# EAGLE design MCT-1601 (EAGLE 7.6.0)
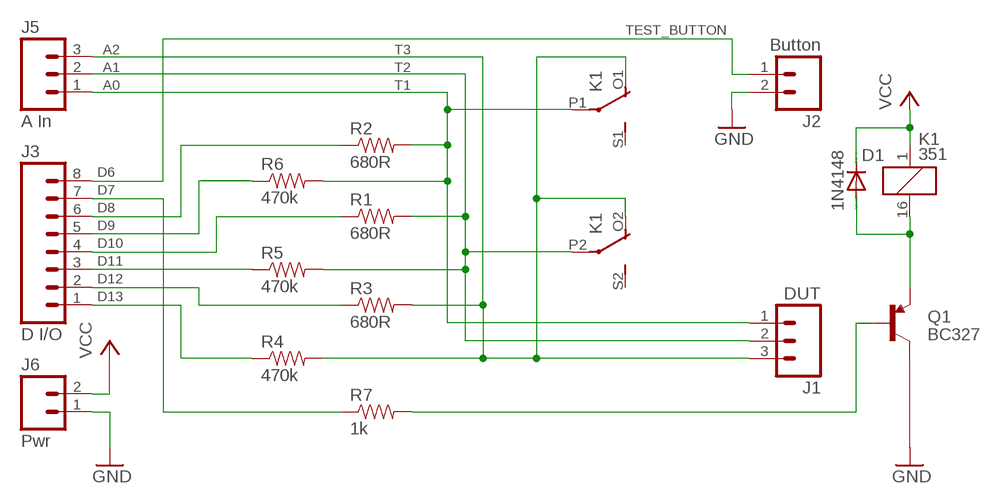
[diagram p0: schematic, sheet 1]

## Parts
D1  1N4148  DIODE-D-2.5  [D-2.5]
J1  DUT  M03PTH  [1X03]
J2  Button  M02PTH  [1X02]
J3  D I/O  M08  [1X08_ROUND]
J5  A In  M03PTH  [1X03]
J6  Pwr  M02PTH  [1X02]
K1  351  [351]
Q1  BC327  SS-PNP-BC327  [TO-92]
R1  680R  1KOHM-1/4W-1%(PTH)VERT  [AXIAL-0.1]
R2  680R  1KOHM-1/4W-1%(PTH)VERT  [AXIAL-0.1]
R3  680R  1KOHM-1/4W-1%(PTH)VERT  [AXIAL-0.1]
R4  470k  1KOHM-1/4W-1%(PTH)VERT  [AXIAL-0.1]
R5  470k  1KOHM-1/4W-1%(PTH)VERT  [AXIAL-0.1]
R6  470k  1KOHM-1/4W-1%(PTH)VERT  [AXIAL-0.1]
R7  1k  1KOHM-1/4W-1%(PTH)VERT  [AXIAL-0.1]

## Nets
D7: J3.7 R7.P$1
D8: J3.6 R2.P$1
D9: J3.5 R6.P$1
D10: J3.4 R1.P$1
D11: J3.3 R5.P$1
D12: J3.2 R3.P$1
D13: J3.1 R4.P$1
GND: J2.2 J6.1 Q1.3(C)
N$2: Q1.2(B) R7.P$2
N$3: D1.A K1.16 Q1.1(E)
T1: J1.1 J5.1 K1.P1(2:P) R2.P$2 R6.P$2
T2: J1.2 J5.2 K1.P2(3:P) R1.P$2 R5.P$2
T3: J1.3 J5.3 K1.O1(2:O) K1.O2(3:O) R3.P$2 R4.P$2
TEST_BUTTON: J2.1 J3.8
VCC: D1.C J6.2 K1.1
Unconnected: K1.S1(2:S) K1.S2(3:S)

## Notes on the sheet
- A2
- A1
- A0
- D6

## Library data of the parts
D1 = diode:DIODE-: DIODE
J1 J5 = SparkFun-Connectors:M03: Header 3 Standard 3-pin 0.1" header. Use with straight break away headers (SKU : PRT-00116), right angle break away headers (PRT-00553), swiss pins (PRT-00743), machine pins (PRT-00117), and female headers (PRT-00115). Molex polarized connector foot print use with SKU : PRT-08232 with associated crimp pins and housings.
J2 J6 = SparkFun-Connectors:M02: Standard 2-pin 0.1" header. Use with - straight break away headers ( PRT-00116) - right angle break away headers (PRT-00553) - swiss pins (PRT-00743) - machine pins (PRT-00117) - female headers (PRT-00115) Molex polarized connector foot print use with: PRT-08233 with associated crimp pins and housings. 2.54_SCREWTERM for use with PRT-10571. 3.5mm Screw Terminal footprints for PRT-08084 5mm Screw Terminal footprints for use with PRT-08432
J3 = SparkFun-Connectors:M08: Header 8 Standard 8-pin 0.1" header. Use with straight break away headers (SKU : PRT-00116), right angle break away headers (PRT-00553), swiss pins (PRT-00743), machine pins (PRT-00117), and female headers (PRT-00115).; PROD_ID: CONN-08437
K1 = relay:351: RELAY 2 x switch, Omron; OC_FARNELL: unknown; OC_NEWARK: unknown
Q1 = 00 Nik misc:SS-PNP-: BC327/807 PNP BJT
R1-R7 = SparkFun-Resistors:1KOHM-1/4W-1%(PTH): RES-12182; PROD_ID: RES-12182; VALUE: 1K

## Board
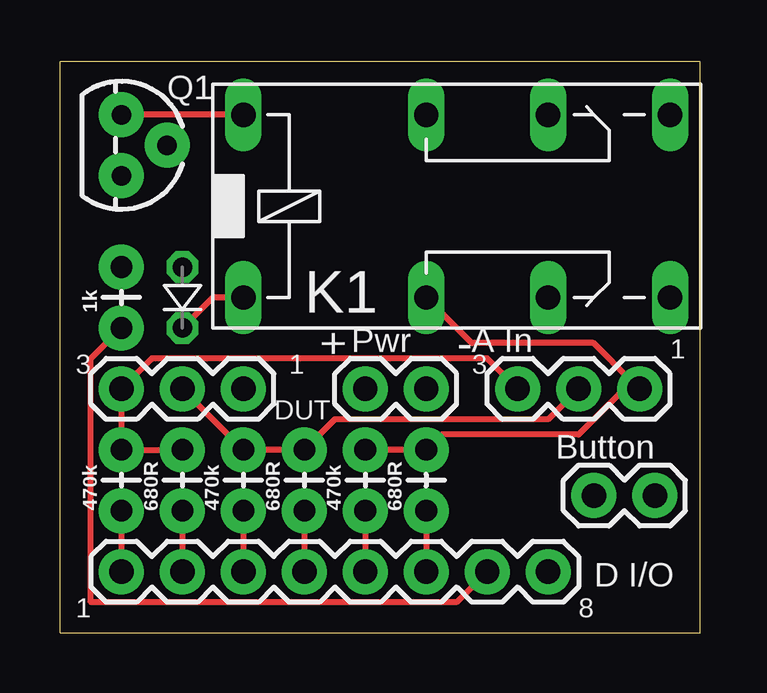
[diagram p1: board, top side]
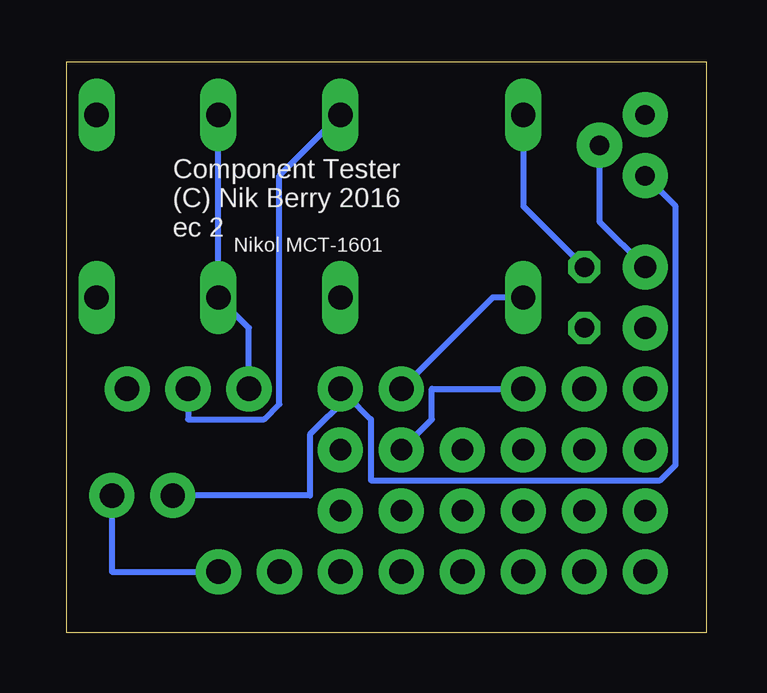
[diagram p2: board, bottom side, seen from below]

Size 26.67 x 23.8 mm. Coordinates in mm from the lower left corner, seen from the top.
Outline: 0.02,0 26.67,0 26.67,23.8 0.02,23.8
Outline: 0,0 0,23.8
Copper layers (1*16): Top 0.035mm / dielectric 1.5mm / Bottom 0.035mm
Design rules "default": minimum track width 10mil, minimum drill 24mil, track to track 8mil, track to pad 8mil, pad to pad 8mil, via to via 8mil, smd to smd 8mil, copper to edge 40mil, drill to drill 8mil, minimum pad ring 10mil, minimum via ring 8mil, stop-mask expansion 4mil, vias tented up to drill 0mil, thermal gap 10mil

### Footprints (pad centres in the part's own frame; a part is rotated, then mirrored left to right if it is on the bottom)
D-2.5 = drill 0.813 octagon: A 1.27,0; C -1.27,0
1X03 = drill 1.016 pad 1.88: 1 0,0; 2 2.54,0; 3 5.08,0
1X02 = drill 1.016 pad 1.88: 1 0,0; 2 2.54,0
1X08_ROUND = drill 1.016 pad 1.88: 1 0,0; 2 2.54,0; 3 5.08,0; 4 7.62,0; 5 10.16,0; 6 12.7,0; 7 15.24,0; 8 17.78,0
351 = drill 1.016 long: 1 -3.81,-3.81; 16 -3.81,3.81; O1 8.89,-3.81; O2 8.89,3.81; P1 3.81,-3.81; P2 3.81,3.81; S1 13.97,-3.81; S2 13.97,3.81
TO-92 = drill 0.813 pad 1.88: 1 -1.27,0; 2 0,1.905; 3 1.27,0
AXIAL-0.1 = drill 0.9 pad 1.88: P$1 0,0; P$2 2.54,0

### Placement (x,y rotation side)
D1  5.1,13.97 90 top
J1  7.64,10.16 180 top
J2  24.79,5.71 180 top
J3  2.56,2.54 0 top
J5  24.15,10.16 180 top
J6  15.26,10.16 180 top
K1  11.45,17.78 0 top
Q1  2.56,20.32 270 top
R1  10.18,5.08 90 top
R2  15.26,5.08 90 top
R3  5.1,5.08 90 top
R4  2.56,5.08 90 top
R5  7.64,5.08 90 top
R6  12.72,5.08 90 top
R7  2.56,12.7 90 top

### Tracks (layer width: path | path; a pad name or v marks a point on that pad's centre or on a via)
D7
  Top 0.254: R7.P$1 1.29,11.43 1.29,1.27 16.53,1.27 J3.7
D8
  Top 0.254: R2.P$1 J3.6
D9
  Top 0.254: R6.P$1 J3.5
D10
  Top 0.254: R1.P$1 J3.4
D11
  Top 0.254: R5.P$1 J3.3
D12
  Top 0.254: R3.P$1 J3.2
D13
  Top 0.254: R4.P$1 J3.1
GND
  Bottom 0.254: Q1.3 1.29,17.78 1.29,6.99 1.93,6.35 13.99,6.35 13.99,8.89 14.94,9.84 | J2.2 16.53,5.71 16.53,8.26 14.94,9.84 | 14.94,9.84 J6.1
N$2
  Bottom 0.254: R7.P$2 4.46,17.14 Q1.2
N$3
  Top 0.254: K1.16 Q1.1
  Bottom 0.254: D1.A 7.64,17.78 K1.16
T1
  Top 0.254: R6.P$2 R2.P$2 15.89,8.26 21.61,8.26 23.83,10.48 | K1.P1 17.16,12.06 22.25,12.06 23.83,10.48 | 23.83,10.48 J5.1
  Bottom 0.254: J1.1 11.45,10.16 11.45,8.89 R6.P$2
T2
  Top 0.254: J1.2 R5.P$2 R1.P$2 11.45,8.89 20.34,8.89 J5.2
  Bottom 0.254: K1.P2 17.8,19.05 17.8,9.53 18.43,8.89 21.61,8.89 J5.2
T3
  Top 0.254: R3.P$2 R4.P$2 J1.3 3.83,11.43 17.8,11.43 J5.3
  Bottom 0.254: J5.3 19.07,12.7 K1.O1 K1.O2
TEST_BUTTON
  Bottom 0.254: J3.8 24.79,2.54 J2.1
VCC
  Top 0.254: D1.C 6.37,13.97 K1.1
  Bottom 0.254: J6.2 8.91,13.97 K1.1

### Text on the board
tNames: 3 | 1 | + | - | 3 | 1 | 1 | 8
bNames: Component Tester / (C) Nik Berry 2016 / ec 2 | Nikol MCT-1601